# Altium schematic sheet USB.SchDoc
size A4; Organization: Altium Limited; Address1: L3, 12a Rodborough Rd; Address2: Frenchs Forest; Address3: NSW; Address4: Australia 2086
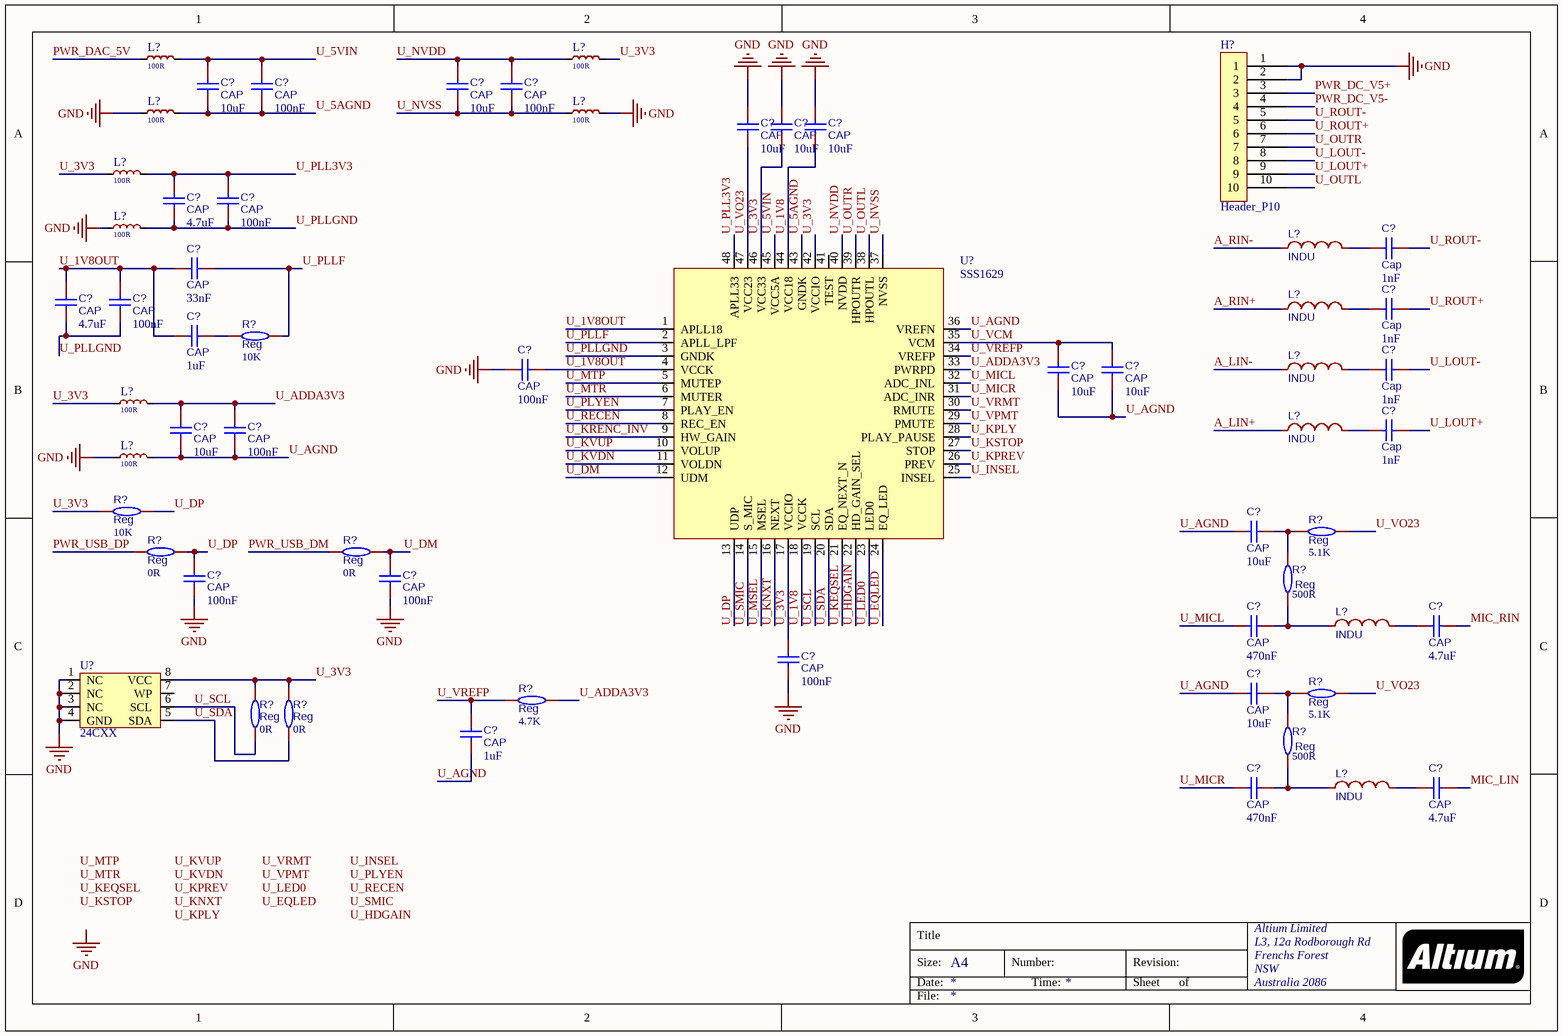
[diagram p0: USB.SchDoc]

## Parts
(Parts that share a designator on the sheet are numbered #1, #2 ... from top to bottom, then left to right.)
C?#1  CAP  value 10uF  [C0603]
C?#2  CAP  value 100nF  [C0603]
C?#3  CAP  value 10uF  [C0603]
C?#4  CAP  value 100nF  [C0603]
C?#5  CAP  value 10uF  [C0603]
C?#6  CAP  value 10uF  [C0603]
C?#7  CAP  value 10uF  [C0603]
C?#8  CAP  value 4.7uF  [C0603]
C?#9  CAP  value 100nF  [C0603]
C?#10  Cap  value 1nF  [C0603]
C?#11  CAP  value 33nF  [C0603]
C?#12  CAP  value 4.7uF  [C0603]
C?#13  CAP  value 100nF  [C0603]
C?#14  Cap  value 1nF  [C0603]
C?#15  CAP  value 1uF  [C0603]
C?#16  CAP  value 100nF  [C0603]
C?#17  CAP  value 10uF  [C0603]
C?#18  CAP  value 10uF  [C0603]
C?#19  Cap  value 1nF  [C0603]
C?#20  CAP  value 10uF  [C0603]
C?#21  CAP  value 100nF  [C0603]
C?#22  Cap  value 1nF  [C0603]
C?#23  CAP  value 10uF  [C0603]
C?#24  CAP  value 100nF  [C0603]
C?#25  CAP  value 100nF  [C0603]
C?#26  CAP  value 470nF  [C0603]
C?#27  CAP  value 4.7uF  [C0603]
C?#28  CAP  value 100nF  [C0603]
C?#29  CAP  value 10uF  [C0603]
C?#30  CAP  value 1uF  [C0603]
C?#31  CAP  value 470nF  [C0603]
C?#32  CAP  value 4.7uF  [C0603]
H?  Header_P10  [H_2.54_P10]
L?#1  value 100R  [L0603]  (hidden comment: 电感磁珠)
L?#2  value 100R  [L0603]  (hidden comment: 电感磁珠)
L?#3  value 100R  [L0603]  (hidden comment: 电感磁珠)
L?#4  value 100R  [L0603]  (hidden comment: 电感磁珠)
L?#5  value 100R  [L0603]  (hidden comment: 电感磁珠)
L?#6  value 100R  [L0603]  (hidden comment: 电感磁珠)
L?#7  INDU  [SMD_L7.1]
L?#8  INDU  [SMD_L7.1]
L?#9  INDU  [SMD_L7.1]
L?#10  value 100R  [L0603]  (hidden comment: 电感磁珠)
L?#11  INDU  [SMD_L7.1]
L?#12  value 100R  [L0603]  (hidden comment: 电感磁珠)
L?#13  INDU  [SMD_L7.1]
L?#14  INDU  [SMD_L7.1]
R?#1  Reg  value 10K  [R0603]
R?#2  Reg  value 10K  [R0603]
R?#3  Reg  value 5.1K  [R0603]
R?#4  Reg  value 0R  [R0603]
R?#5  Reg  value 0R  [R0603]
R?#6  Reg  value 500R  [R0603]
R?#7  Reg  value 5.1K  [R0603]
R?#8  Reg  value 4.7K  [R0603]
R?#9  Reg  value 0R  [R0603]
R?#10  Reg  value 0R  [R0603]
R?#11  Reg  value 500R  [R0603]
U?#1  SSS1629
U?#2  24CXX  [SOP-8]

## Nets
GND: C?#5.1 C?#6.1 C?#7.1 C?#16.1 C?#24.2 C?#25.2 C?#28.1 H?.1 H?.2 L?#3.1 L?#4.2 L?#6.1 L?#12.1 U?#2.1(NC) U?#2.2(NC) U?#2.3(NC) U?#2.4(GND)
A_LIN+: L?#11.1
A_LIN-: L?#9.1
A_RIN+: L?#8.1
A_RIN-: L?#7.1
MIC_LIN: C?#32.1
MIC_RIN: C?#27.1
PWR_DAC_5V: L?#1.1
PWR_DC_V5+: H?.3
PWR_DC_V5-: H?.4
PWR_USB_DM: R?#5.1
PWR_USB_DP: R?#4.1
U_1V8: C?#7.2 U?#1.18(VCCK) U?#1.44(VCC18)
U_1V8OUT: C?#11.1 C?#12.1 C?#13.1 C?#15.1 C?#16.2 U?#1.1(APLL18) U?#1.4(VCCK)
U_3V3: C?#6.2 C?#28.2 L?#2.2 L?#5.1 L?#10.1 R?#2.1 R?#9.2 R?#10.2 U?#1.17(VCCIO) U?#1.42(VCCIO) U?#1.46(VCC33) U?#2.8(VCC)
U_5AGND: C?#1.2 C?#2.2 L?#3.2 U?#1.43(GNDK)
U_5VIN: C?#1.1 C?#2.1 L?#1.2 U?#1.45(VCC5A)
U_ADDA3V3: C?#20.1 C?#21.1 L?#10.2 R?#8.2 U?#1.33(PWRPD)
U_AGND: C?#17.2 C?#18.2 C?#20.2 C?#21.2 C?#23.1 C?#29.1 C?#30.1 L?#12.2 U?#1.36(VREFN)
U_DM: C?#25.1 R?#5.2 U?#1.12(UDM)
U_DP: C?#24.1 R?#2.2 R?#4.2 U?#1.13(UDP)
U_EQLED: U?#1.24(EQ_LED)
U_HDGAIN: U?#1.22(HD_GAIN_SEL)
U_INSEL: U?#1.25(INSEL)
U_KEQSEL: U?#1.21(EQ_NEXT_N)
U_KNXT: U?#1.16(NEXT)
U_KPLY: U?#1.28(PLAY_PAUSE)
U_KPREV: U?#1.26(PREV)
U_KRENC_INV: U?#1.9(HW_GAIN)
U_KSTOP: U?#1.27(STOP)
U_KVDN: U?#1.11(VOLDN)
U_KVUP: U?#1.10(VOLUP)
U_LED0: U?#1.23(LED0)
U_LOUT+: C?#22.2 H?.9
U_LOUT-: C?#19.2 H?.8
U_MICL: C?#26.1 U?#1.32(ADC_INL)
U_MICR: C?#31.1 U?#1.31(ADC_INR)
U_MSEL: U?#1.15(MSEL)
U_MTP: U?#1.5(MUTEP)
U_MTR: U?#1.6(MUTER)
U_NVDD: C?#3.1 C?#4.1 L?#2.1 U?#1.40(NVDD)
U_NVSS: C?#3.2 C?#4.2 L?#4.1 U?#1.37(NVSS)
U_OUTL: H?.10 U?#1.38(HPOUTL)
U_OUTR: H?.7 U?#1.39(HPOUTR)
U_PLL3V3: C?#8.1 C?#9.1 L?#5.2 U?#1.48(APLL33)
U_PLLF: C?#11.2 R?#1.2 U?#1.2(APLL_LPF)
U_PLLGND: C?#8.2 C?#9.2 C?#12.2 C?#13.2 L?#6.2 U?#1.3(GNDK)
U_PLYEN: U?#1.7(PLAY_EN)
U_RECEN: U?#1.8(REC_EN)
U_ROUT+: C?#14.2 H?.6
U_ROUT-: C?#10.2 H?.5
U_SCL: R?#9.1 U?#1.19(SCL) U?#2.6(SCL)
U_SDA: R?#10.1 U?#1.20(SDA) U?#2.5(SDA)
U_SMIC: U?#1.14(S_MIC)
U_VCM: C?#17.1 C?#18.1 U?#1.35(VCM)
U_VO23: C?#5.2 R?#3.1 R?#7.1 U?#1.47(VCC23)
U_VPMT: U?#1.29(PMUTE)
U_VREFP: C?#30.2 R?#8.1 U?#1.34(VREFP)
U_VRMT: U?#1.30(RMUTE)
NetC?#10_1: C?#10.1 L?#7.2
NetC?#14_1: C?#14.1 L?#8.2
NetC?#15_2: C?#15.2 R?#1.1
NetC?#19_1: C?#19.1 L?#9.2
NetC?#22_1: C?#22.1 L?#11.2
NetC?#23_2: C?#23.2 R?#3.2 R?#6.1
NetC?#26_2: C?#26.2 L?#13.1 R?#6.2
NetC?#27_2: C?#27.2 L?#13.2
NetC?#29_2: C?#29.2 R?#7.2 R?#11.1
NetC?#31_2: C?#31.2 L?#14.1 R?#11.2
NetC?#32_2: C?#32.2 L?#14.2

Not connected (* = marked no-connect by the designer): U?#1 41(TEST); U?#2 7(WP)

## Notes on the sheet
- Labels drawn without touching a wire or pin: GND, U_EQLED, U_HDGAIN, U_INSEL, U_KEQSEL, U_KNXT, U_KPLY, U_KPREV, U_KSTOP, U_KVDN, U_KVUP, U_LED0, U_MTP, U_MTR, U_PLYEN, U_RECEN, U_SMIC, U_VPMT, U_VRMT
- Title
- Size:
- Date:
- A4
- Number:
- Time:
- Revision:
- Sheet
- of
- File:

## Library data of the parts
C?#1-C?#32 = CAP: BOM_Manufacturer: Huaxin S&T; BOM_Manufacturer Part: 0603B103K101CT; nameAlias: Capacitance; Contributor: LCSC; BOM_Supplier: LCSC; BOM_Supplier Part: C302008; spicePre: C; spiceSymbolName: 0603B103K101CT
H? = Header_P10: Header 10Pin
L?#1-L?#6 L?#10 L?#12 = IND_FB
L?#7-L?#9 L?#11 L?#13 L?#14 = IND: 电感; BOM_Manufacturer: Sunltech Tech; BOM_Manufacturer Part: SLO0630H150MTT; nameAlias: Inductance; Contributor: LCSC; BOM_Supplier: LCSC; BOM_Supplier Part: C182182; BOM_JLCPCB Part Class: Extended Part; spicePre: L; spiceSymbolName: SLO0630H150MTT; Value: *
R?#1-R?#11 = Res: 电阻; BOM_Manufacturer: Viking Tech; BOM_Manufacturer Part: AR03BTCX1002A; nameAlias: Resistance (Ohms); Contributor: LCSC; BOM_Supplier: LCSC; BOM_Supplier Part: C465721; spicePre: R; spiceSymbolName: AR03BTCX1002A
U?#1 = SSS1629: USB Audio IC
U?#2 = 24CXX: 24CXX EEPROM